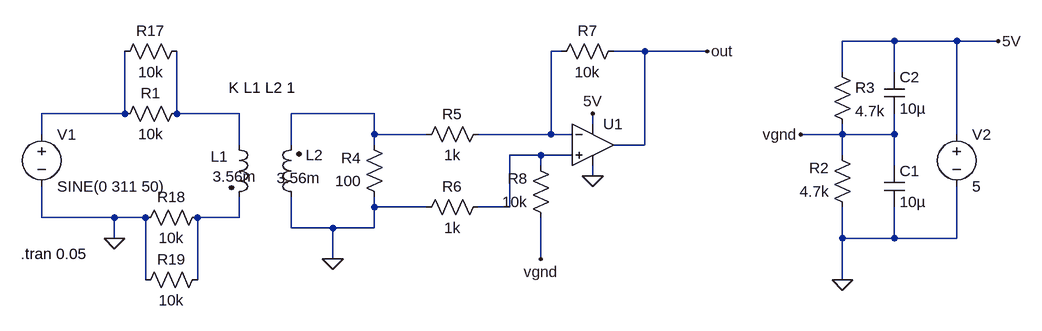
[diagram p0: schematic voltaje.asc]
voltaje.asc, the LTspice schematic file:
Version 4
SHEET 1 2472 680
WIRE 1104 -80 1024 -80
WIRE 1200 -80 1104 -80
WIRE 1264 -80 1200 -80
WIRE 592 -64 576 -64
WIRE 720 -64 672 -64
WIRE 816 -64 720 -64
WIRE 1024 -32 1024 -80
WIRE 1104 -32 1104 -80
WIRE -80 32 -80 -64
WIRE -80 32 -208 32
WIRE 0 32 0 -64
WIRE 96 32 0 32
WIRE 304 32 176 32
WIRE 640 48 640 32
WIRE -208 64 -208 32
WIRE 304 64 304 32
WIRE 384 64 304 64
WIRE 576 64 576 -64
WIRE 576 64 464 64
WIRE 608 64 576 64
WIRE 1024 64 1024 48
WIRE 1024 64 960 64
WIRE 1104 64 1104 32
WIRE 1104 64 1024 64
WIRE 1200 64 1200 -80
WIRE 96 80 96 32
WIRE 176 80 176 32
WIRE 304 80 304 64
WIRE 720 80 720 -64
WIRE 720 80 672 80
WIRE 560 96 512 96
WIRE 608 96 560 96
WIRE 1024 96 1024 64
WIRE 560 112 560 96
WIRE 1104 112 1104 64
WIRE 640 128 640 112
WIRE 304 176 304 160
WIRE 384 176 304 176
WIRE 512 176 512 96
WIRE 512 176 464 176
WIRE -208 192 -208 144
WIRE -96 192 -208 192
WIRE -48 192 -96 192
WIRE 96 192 96 160
WIRE 96 192 32 192
WIRE 176 208 176 160
WIRE 240 208 176 208
WIRE 304 208 304 176
WIRE 304 208 240 208
WIRE -96 224 -96 192
WIRE 1024 224 1024 176
WIRE 1104 224 1104 176
WIRE 1104 224 1024 224
WIRE 1200 224 1200 144
WIRE 1200 224 1104 224
WIRE 240 256 240 208
WIRE 560 256 560 192
WIRE -48 288 -48 192
WIRE 32 288 32 192
WIRE 1024 288 1024 224
FLAG -96 224 0
FLAG 1024 288 0
FLAG 640 128 0
FLAG 240 256 0
FLAG 960 64 vgnd
FLAG 816 -64 out
FLAG 560 256 vgnd
FLAG 640 32 5V
FLAG 1264 -80 5V
SYMBOL ind2 80 64 R0
WINDOW 0 -28 34 Left 2
WINDOW 3 -25 65 Left 2
SYMATTR InstName L1
SYMATTR Value 3.56m
SYMATTR Type ind
SYMATTR SpiceLine Rser=0.6
SYMBOL ind2 192 176 R180
WINDOW 0 -33 80 Left 2
WINDOW 3 -29 45 Left 2
SYMATTR InstName L2
SYMATTR Value 3.56m
SYMATTR Type ind
SYMATTR SpiceLine Rser=0.6
SYMBOL voltage -208 48 R0
WINDOW 123 0 0 Left 0
WINDOW 39 0 0 Left 0
SYMATTR InstName V1
SYMATTR Value SINE(0 311 50)
SYMBOL res 16 16 R90
WINDOW 0 0 56 VBottom 2
WINDOW 3 32 56 VTop 2
SYMATTR InstName R1
SYMATTR Value 10k
SYMATTR SpiceLine tol=5
SYMBOL res 1040 192 R180
WINDOW 0 36 76 Left 2
WINDOW 3 36 40 Left 2
SYMATTR InstName R2
SYMATTR Value 4.7k
SYMBOL res 1008 -48 R0
SYMATTR InstName R3
SYMATTR Value 4.7k
SYMBOL voltage 1200 48 R0
WINDOW 123 0 0 Left 0
WINDOW 39 0 0 Left 0
SYMATTR InstName V2
SYMATTR Value 5
SYMBOL res 320 176 R180
WINDOW 0 36 76 Left 2
WINDOW 3 36 40 Left 2
SYMATTR InstName R4
SYMATTR Value 100
SYMBOL cap 1088 112 R0
SYMATTR InstName C1
SYMATTR Value 10µ
SYMBOL Opamps\\UniversalOpamp2 640 80 R0
SYMATTR InstName U1
SYMBOL res 480 48 R90
WINDOW 0 0 56 VBottom 2
WINDOW 3 32 56 VTop 2
SYMATTR InstName R5
SYMATTR Value 1k
SYMBOL res 480 160 R90
WINDOW 0 0 56 VBottom 2
WINDOW 3 32 56 VTop 2
SYMATTR InstName R6
SYMATTR Value 1k
SYMBOL res 688 -80 R90
WINDOW 0 0 56 VBottom 2
WINDOW 3 32 56 VTop 2
SYMATTR InstName R7
SYMATTR Value 10k
SYMBOL res 576 208 R180
WINDOW 0 36 76 Left 2
WINDOW 3 36 40 Left 2
SYMATTR InstName R8
SYMATTR Value 10k
SYMBOL res 16 -80 R90
WINDOW 0 0 56 VBottom 2
WINDOW 3 32 56 VTop 2
SYMATTR InstName R17
SYMATTR Value 10k
SYMATTR SpiceLine tol=5
SYMBOL res 48 176 R90
WINDOW 0 0 56 VBottom 2
WINDOW 3 32 56 VTop 2
SYMATTR InstName R18
SYMATTR Value 10k
SYMATTR SpiceLine tol=5
SYMBOL res 48 272 R90
WINDOW 0 0 56 VBottom 2
WINDOW 3 32 56 VTop 2
SYMATTR InstName R19
SYMATTR Value 10k
SYMATTR SpiceLine tol=5
SYMBOL cap 1088 -32 R0
SYMATTR InstName C2
SYMATTR Value 10µ
TEXT 80 -8 Left 2 !K L1 L2 1
TEXT -240 248 Left 2 !.tran 0.05

The netlist it stands for:
* voltaje.asc
L1 N003 N006 3.56m Rser=0.6
L2 0 N004 3.56m Rser=0.6
V1 N002 0 SINE(0 311 50)
R1 N003 N002 10k tol=5
R2 0 vgnd 4.7k
R3 5V vgnd 4.7k
V2 5V 0 5
R4 0 N004 100
C1 vgnd 0 10µ
XU1 N005 N001 5V 0 out level.2 Avol=1Meg GBW=10Meg Slew=10Meg ilimit=25m rail=0 Vos=0 phimargin=45 en=0 enk=0 in=0 ink=0 Rin=500Meg  ; pins IN+ IN- V+ V- OUT
R5 N001 N004 1k
R6 N005 0 1k
R7 out N001 10k
R8 vgnd N005 10k
R17 N003 N002 10k tol=5
R18 N006 0 10k tol=5
R19 N006 0 10k tol=5
C2 5V vgnd 10µ
K L1 L2 1
.tran 0.05
.lib UniversalOpamps2.sub
.backanno
.end